# EAGLE design Tubes board (EAGLE 9.4.2)
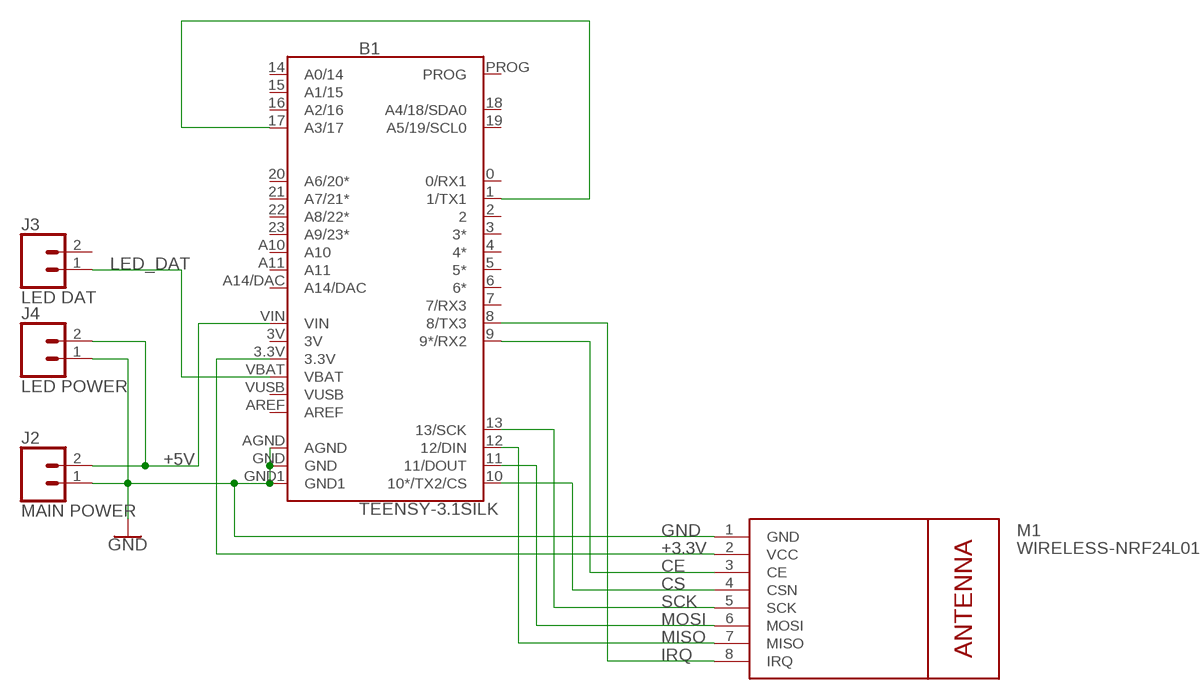
[diagram p0: schematic, sheet 1]

## Parts
B1  TEENSY-3.1SILK  [TEENSY-3.1]
J2  MAIN POWER  CONN_025MM  [SCREWTERMINAL-5MM-2]
J3  LED DAT  CONN_025MM  [SCREWTERMINAL-5MM-2]
J4  LED POWER  CONN_025MM  [SCREWTERMINAL-5MM-2]
M1  WIRELESS-NRF24L01  [WIRELESS-NRF24L01]

## Nets
+3.3V: B1.3.3V M1.2(VCC)
+5V: B1.VIN J2.2 J4.2
CE: B1.9(9*/RX2) M1.3(CE)
CS: B1.10(10*/TX2/CS) M1.4(CSN)
DAT: B1.1(1/TX1) B1.17(A3/17)
GND: B1.AGND B1.GND B1.GND1 J2.1 J4.1 M1.1(GND)
IRQ: B1.8(8/TX3) M1.8(IRQ)
LED_DAT: B1.VBAT J3.1
MISO: B1.12(12/DIN) M1.7(MISO)
MOSI: B1.11(11/DOUT) M1.6(MOSI)
SCK: B1.13(13/SCK) M1.5(SCK)
Unconnected: B1.0(0/RX1) B1.2 B1.3(3*) B1.4(4*) B1.5(5*) B1.6(6*) B1.7(7/RX3) B1.14(A0/14) B1.15(A1/15) B1.16(A2/16) B1.18(A4/18/SDA0) B1.19(A5/19/SCL0) B1.20(A6/20*) B1.21(A7/21*) B1.22(A8/22*) B1.23(A9/23*) B1.A10 B1.A11 B1.A14/DAC B1.AREF B1.PROG J3.2

## Power pins joined to a net without a drawn wire
3V: B1.3V
VUSB: B1.VUSB

## Library data of the parts
B1 = SparkFun-Boards:TEENSY-3.1: Teensy 3+ Footprint Mechanical footprint with connectors for Teensy Development Board with ARM Cortex. SparkFun Products: Teensy 3.2 <https://www.sparkfun.com/products/13736> Teensy LC <https://www.sparkfun.com/products/13305>; SF_ID: DEV-12646
J2-J4 = SparkFun-Connectors:CONN_02: Multi connection point. Often used as Generic Header-pin footprint for 0.1 inch spaced/style header connections On any of the 0.1 inch spaced packages, you can populate with these: Break Away Headers - Straight <https://www.sparkfun.com/products/116> (PRT-00116) Break Away Male Headers - Right Angle <https://www.sparkfun.com/products/553> (PRT-00553) Female Headers <https://www.sparkfun.com/products/115> (PRT-00115) Break Away Headers - Machine Pin <https://www.sparkfun.com/products/117> (PRT-00117) Break Away Female Headers - Swiss Machine Pin <https://www.sparkfun.com/products/743> (PRT-00743) For SCREWTERMINALS and SPRING TERMINALS visit here: Screw Terimnals on SparkFun.com <https://www.sparkfun.com/search/results?term=Screw+Terminals> (5mm/3.5mm/2.54mm spacing) This device is also useful as a general connection point to wire up your design to another part of your project. Our various solder wires solder well into these plated through hole pads. Hook-Up Wire - Assortment (Stranded, 22 AWG) <https://www.sparkfun.com/products/11375> (PRT-11375) Hook-Up Wire - Assortment (Solid Core, 22 AWG) <https://www.sparkfun.com/products/11367> (PRT-11367) View the entire wire category on our website here <https://www.sparkfun.com/categories/141> Special notes: Molex polarized connector foot print use with: PRT-08233 with associated crimp pins and housings. 2.54_SCREWTERM for use with PRT-10571. 3.5mm Screw Terminal footprints for PRT-08084 5mm Screw Terminal footprints for use with PRT-08432; SF_SKU: PRT-08432
M1 = diy-modules:WIRELESS-NRF24L01: 2.4 GHz Wireless Module based on NRF24L01 chip More details available here: http://www.electrodragon.com/w/NRF24L01 Click here to find device on ebay.com <http://www.ebay.com/sch/nrf24l01+arduino>

## Board
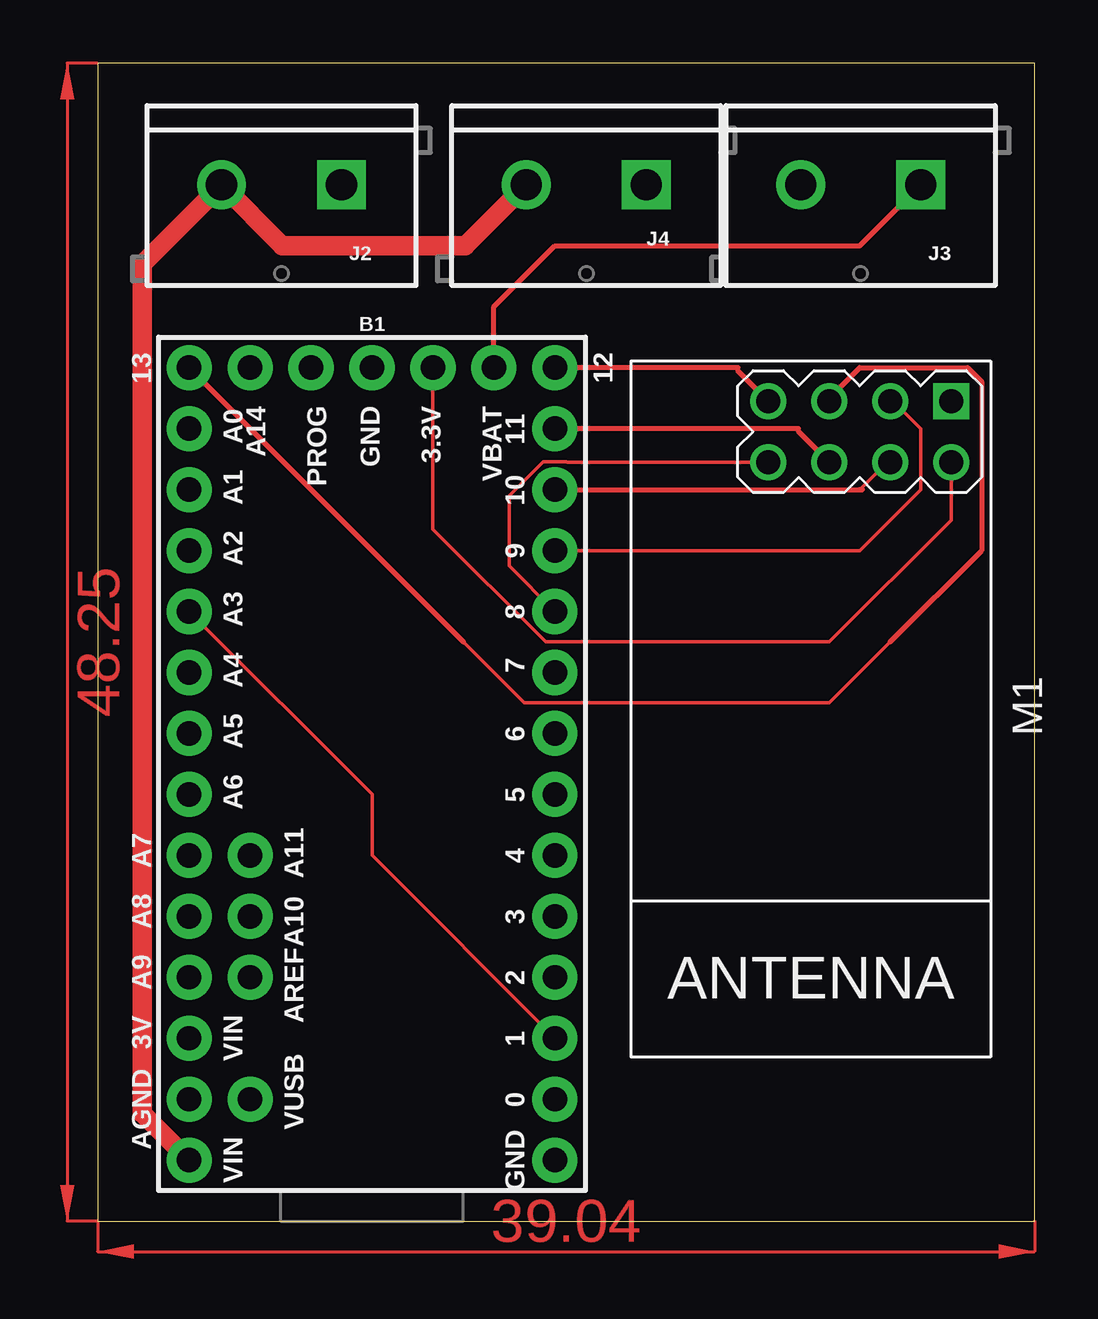
[diagram p1: board, top side]
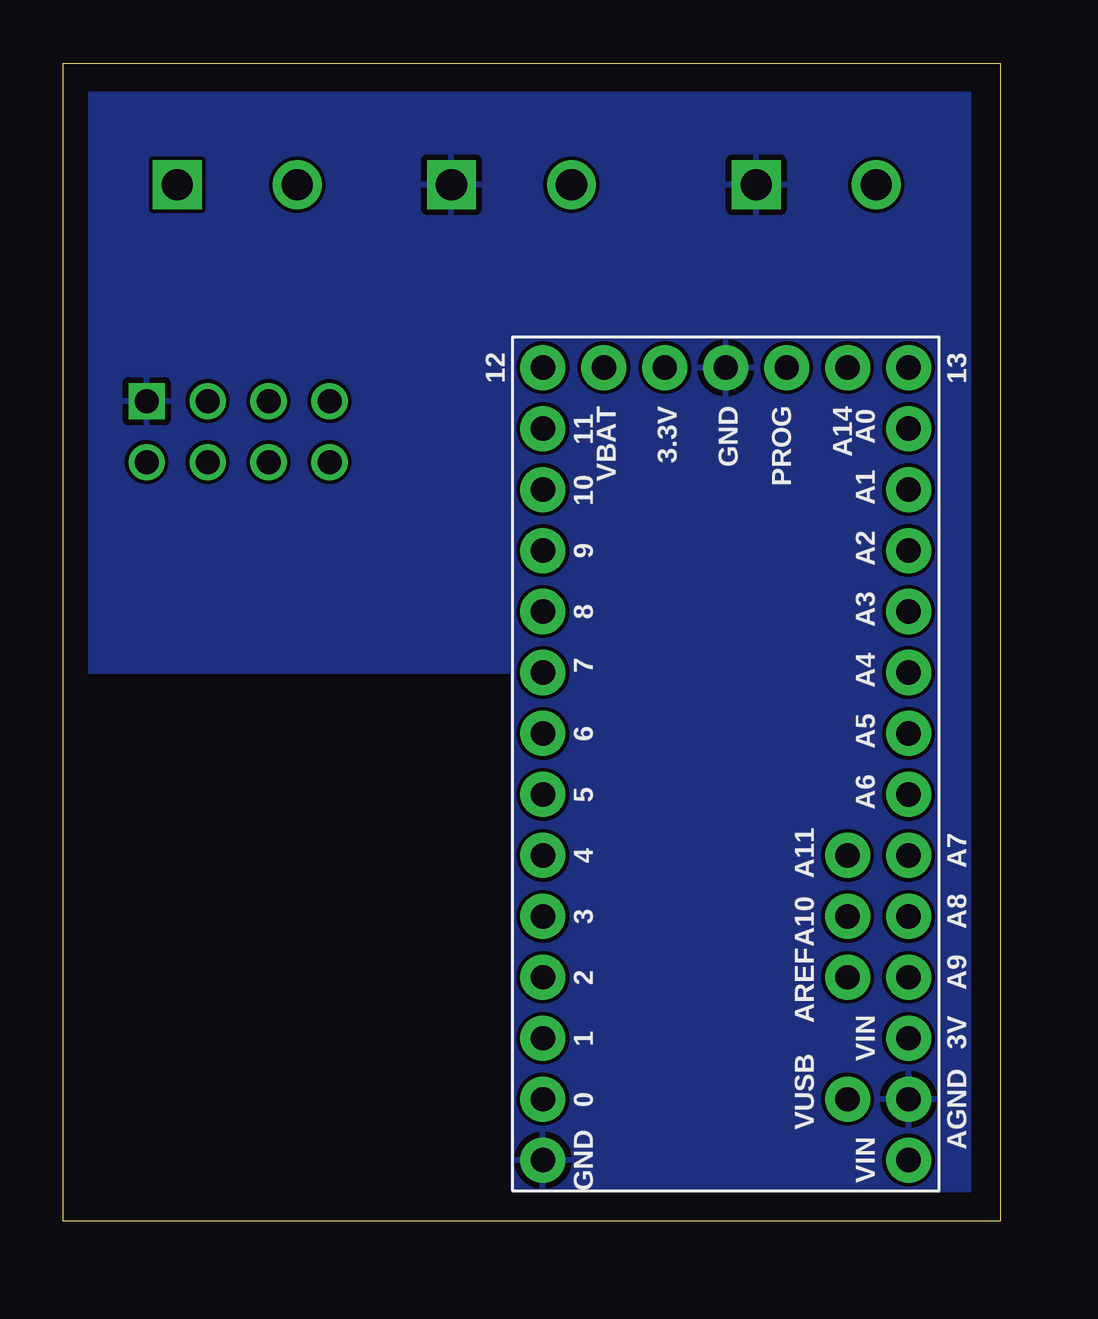
[diagram p2: board, bottom side, seen from below]

Size 39.04 x 48.25 mm. Coordinates in mm from the lower left corner, seen from the top.
Outline: 0,0 39.04,0 39.04,48.25 0,48.25 0,0
Copper layers (1*16): Top 0.035mm / dielectric 1.5mm / Bottom 0.035mm
Design rules "default": minimum track width 6mil, minimum drill 0.35mm, track to track 6mil, track to pad 6mil, pad to pad 6mil, via to via 6mil, smd to smd 6mil, copper to edge 40mil, drill to drill 6mil, minimum pad ring 10mil, minimum via ring 8mil, stop-mask expansion 4mil, vias tented up to drill 0mil, thermal gap 10mil

### Footprints (pad centres in the part's own frame; a part is rotated, then mirrored left to right if it is on the bottom)
TEENSY-3.1 = drill 1.016 pad 1.88: 0 7.62,-13.97; 1 7.62,-11.43; 2 7.62,-8.89; 3 7.62,-6.35; 3.3V 2.54,16.51; 3V -7.62,-11.43; 4 7.62,-3.81; 5 7.62,-1.27; 6 7.62,1.27; 7 7.62,3.81; 8 7.62,6.35; 9 7.62,8.89; 10 7.62,11.43; 11 7.62,13.97; 12 7.62,16.51; 13 -7.62,16.51; 14 -7.62,13.97; 15 -7.62,11.43; 16 -7.62,8.89; 17 -7.62,6.35; 18 -7.62,3.81; 19 -7.62,1.27; 20 -7.62,-1.27; 21 -7.62,-3.81; 22 -7.62,-6.35; 23 -7.62,-8.89; A10 -5.08,-6.35; A11 -5.08,-3.81; A14/DAC -5.08,16.51; AGND -7.62,-13.97; AREF -5.08,-8.89; GND 0,16.51; GND1 7.62,-16.51; PROG -2.54,16.51; VBAT 5.08,16.51; VIN -7.62,-16.51; VUSB -5.08,-13.97
SCREWTERMINAL-5MM-2 = drill 1.3 pad 2.032 square: 1 0,0 | drill 1.3 pad 2.032: 2 5,0
WIRELESS-NRF24L01 = drill 1 square: 1 -12.7,6.35 | drill 1: 2 -10.16,6.35; 3 -12.7,3.81; 4 -10.16,3.81; 5 -12.7,1.27; 6 -10.16,1.27; 7 -12.7,-1.27; 8 -10.16,-1.27

### Placement (x,y rotation side)
B1  11.43,19.05 0 top
J2  10.16,43.18 180 top
J3  34.29,43.18 180 top
J4  22.86,43.18 180 top
M1  29.21,21.46 270 top

### Tracks (layer width: path | path; a pad name or v marks a point on that pad's centre or on a via)
+3.3V
  Top 0.152: M1.2 35.56,29.21 30.48,24.13 18.67,24.13 13.97,28.83 B1.3.3V
+5V
  Top 0.813: B1.VIN 1.86,4.49 1.86,39.88 J2.2 7.7,40.64 15.32,40.64 J4.2
CE
  Top 0.152: B1.9 31.75,27.94 34.29,30.48 34.29,33.02 33.15,34.16 M1.3
CS
  Top 0.152: 31.75,30.48 32.89,31.62 M1.4
  Top 0.203: B1.10 31.75,30.48 31.88,30.48
DAT
  Top 0.152: B1.1 11.43,15.24 11.43,17.78 B1.17
GND
  pour Bottom: 1.27,46.99 38.1,46.99 38.1,22.86 1.27,22.86
  pour Bottom: 1.27,22.86 20.32,22.86 20.32,1.27 2.54,1.27 1.27,1.27
IRQ
  Top 0.152: M1.8 19.56,31.62 19.53,31.65 18.57,31.65 18.54,31.62 17.14,30.23 17.14,27.3 B1.8
LED_DAT
  Top 0.203: B1.VBAT 16.51,38.1 19.05,40.64 31.75,40.64 J3.1
MISO
  Top 0.152: 26.67,35.43 26.67,35.56 | M1.7 27.88,34.23
  Top 0.203: 26.67,35.56 B1.12 | 27.88,34.23 26.67,35.43
MOSI
  Top 0.152: 29.21,32.89 29.21,33.02
  Top 0.203: 29.21,33.02 B1.11 | M1.6 29.21,32.89
SCK
  Top 0.152: M1.5 30.48,34.29 | 15.24,24.13 17.78,21.59 30.48,21.59 33.02,24.13
  Top 0.203: B1.13 15.24,24.13 | 33.02,24.13 36.83,27.94 36.83,34.98 36.25,35.56 31.75,35.56 30.48,34.29
(copper drawn outside any net)
  shapes: Top area x2